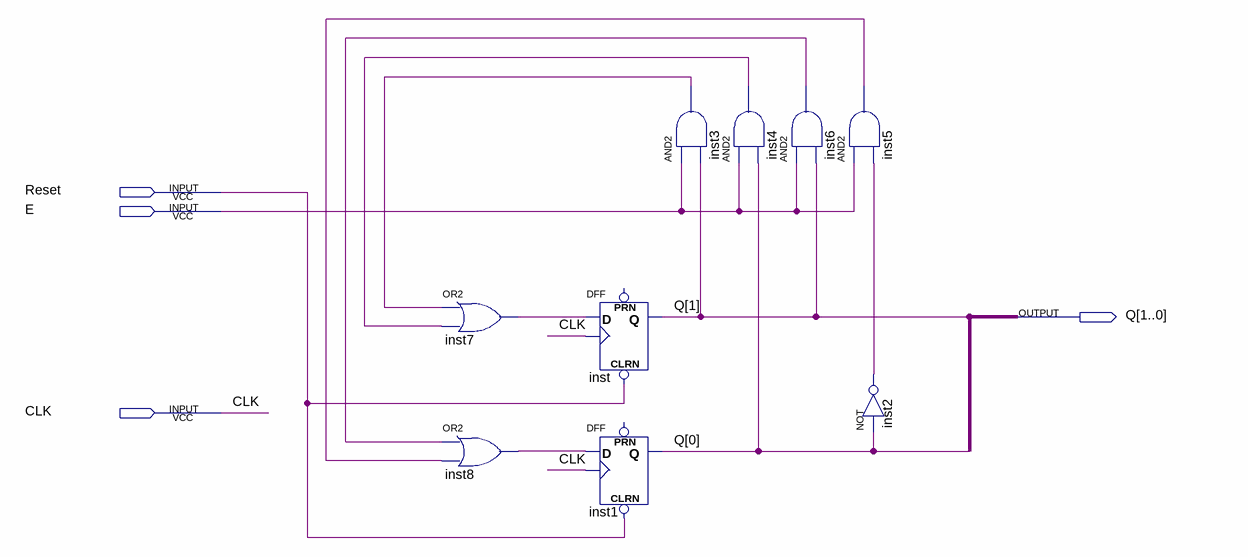
[diagram p0: schematic sheet]
// Quartus schematic counter.bdf as structural Verilog: 9 symbols, 4 pins
module counter (
  input  Reset,
  input  E,
  input  CLK,
  output [1:0] Q
);

  wire inst2_out, inst3_out, inst4_out, inst5_out, inst6_out, inst7_out, inst8_out;

  or inst7 (inst7_out, inst3_out, inst4_out);
  or inst8 (inst8_out, inst6_out, inst5_out);
  DFF inst (.CLRN(Reset), .CLK(CLK), .D(inst7_out), .Q(Q[1]));  // open: PRN
  DFF inst1 (.CLRN(Reset), .CLK(CLK), .D(inst8_out), .Q(Q[0]));  // open: PRN
  and inst3 (inst3_out, E, Q[1]);
  and inst4 (inst4_out, E, Q[0]);
  and inst6 (inst6_out, E, Q[1]);
  and inst5 (inst5_out, E, inst2_out);
  not inst2 (inst2_out, Q[0]);
endmodule
